# EAGLE design ShaqJr-TOP (EAGLE 9.6.2)
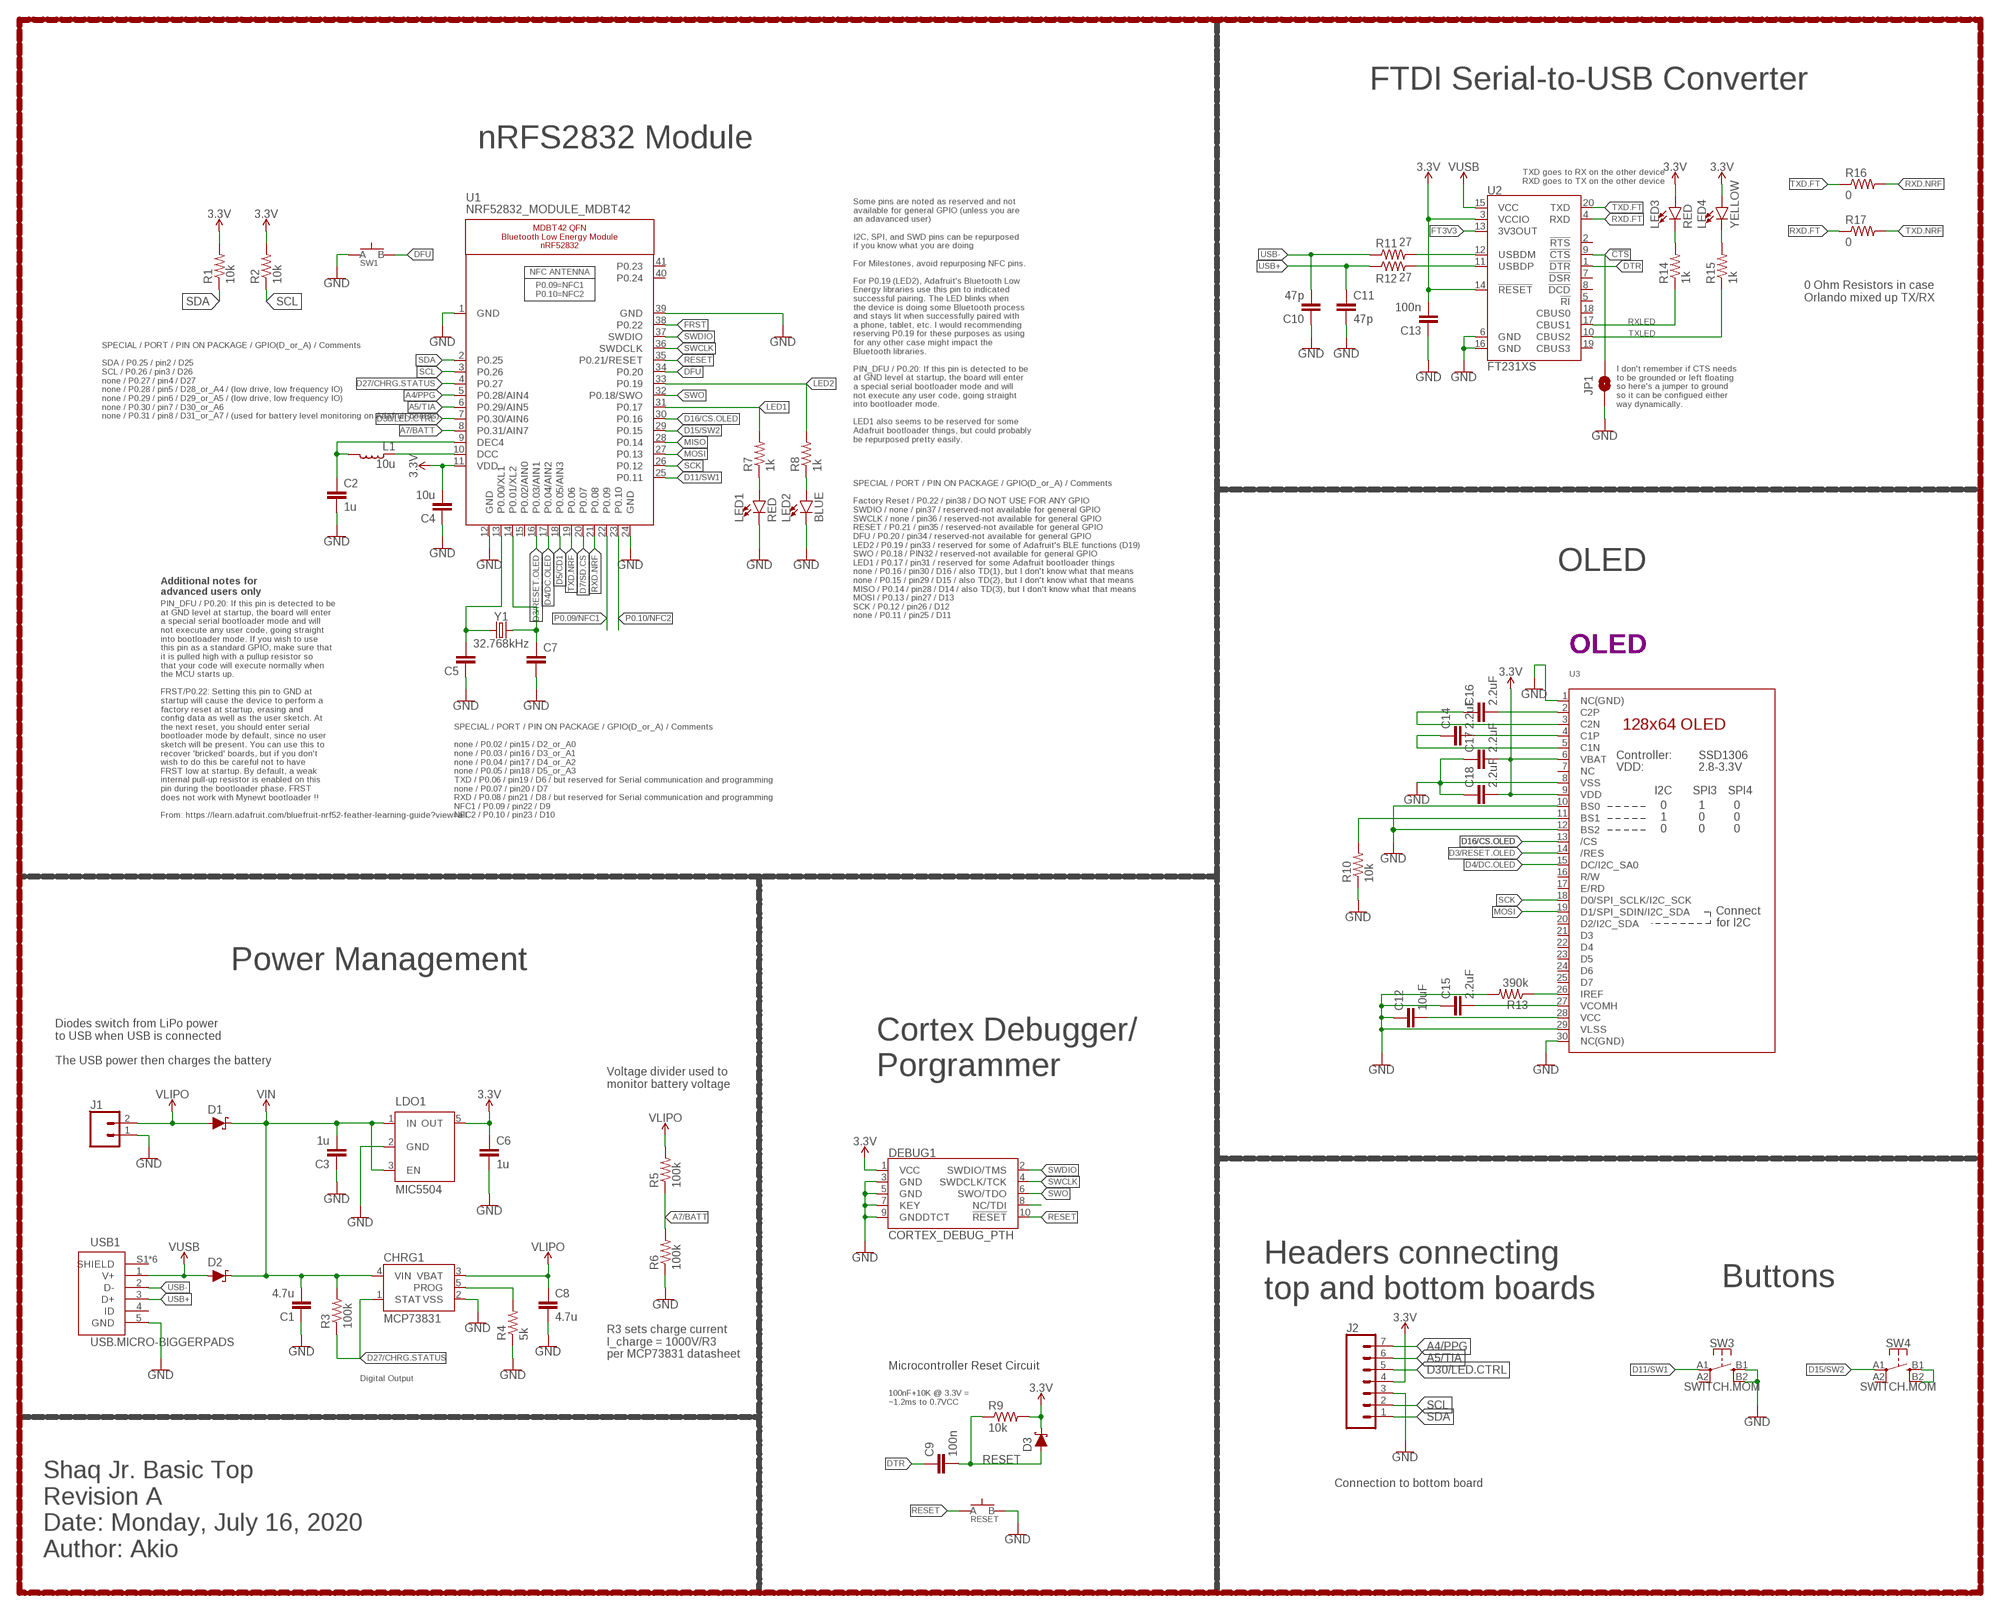
[diagram p0: schematic, sheet 1, part 1 of 2]
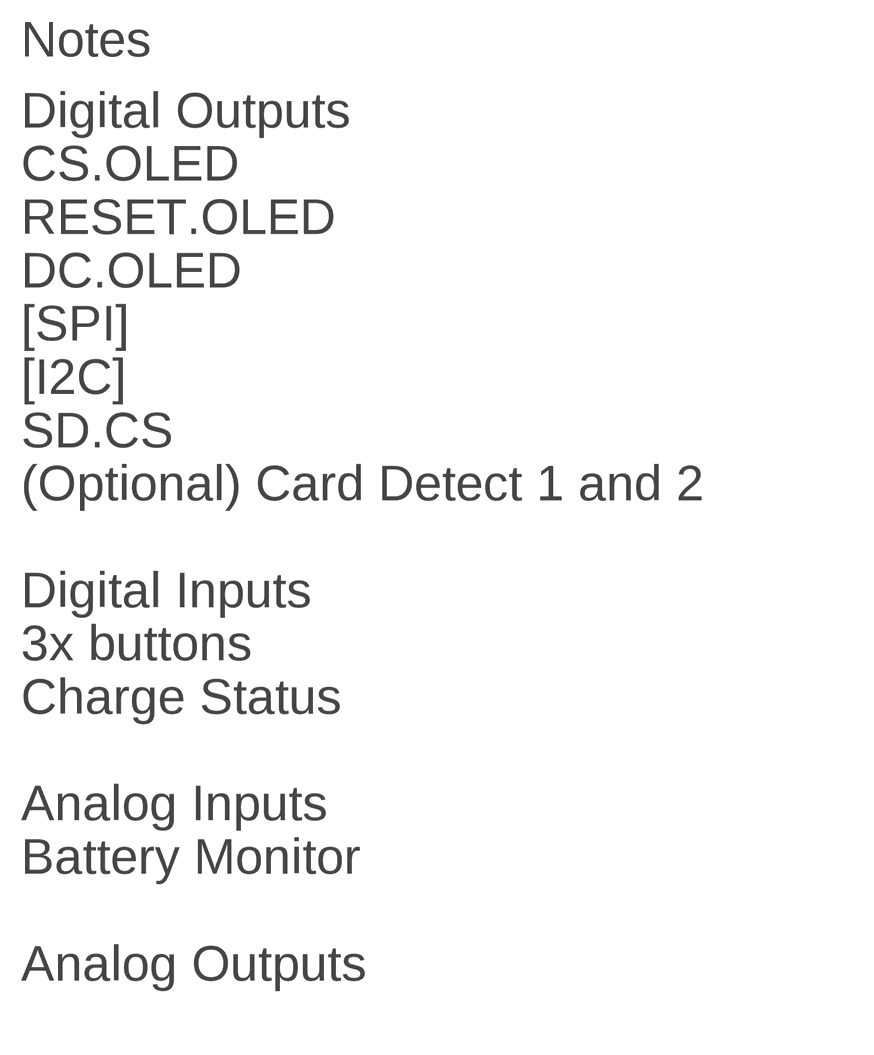
[diagram p1: schematic, sheet 1, part 2 of 2]

## Parts
C1  4.7u  CAPACITOR0603  [C0603]
C2  1u  CAPACITOR0603  [C0603]
C3  1u  CAPACITOR0603  [C0603]
C4  10u  CAPACITOR0805  [C0805]
C5  CAPACITOR0603  [C0603]
C6  1u  CAPACITOR0603  [C0603]
C7  CAPACITOR0603  [C0603]
C8  4.7u  CAPACITOR0603  [C0603]
C9  100n  CAPACITOR0603  [C0603]
C10  47p  CAPACITOR0603  [C0603]
C11  47p  CAPACITOR0603  [C0603]
C12  10uF  CAPACITOR0603  [C0603]
C13  100n  CAPACITOR0603  [C0603]
C14  2.2uF  CAPACITOR0402  [C0402]
C15  2.2uF  CAPACITOR0603  [C0603]
C16  2.2uF  CAPACITOR0402  [C0402]
C17  2.2uF  CAPACITOR0402  [C0402]
C18  2.2uF  CAPACITOR0402  [C0402]
CHRG1  MCP73831  [SOT23-5]
D1  SCHOTTKY-USC  [USC]
D2  SCHOTTKY-USC  [USC]
D3  SCHOTTKY-USC  [USC]
DEBUG1  CORTEX_DEBUG_PTH  [2X5-PTH-1.27MM]
J1  CONN_02  [1X02]
J2  CONN_07-1.27MM  [1X07_1.27MM]
JP1  JUMPER-SMT_2_NO_SILK  [SMT-JUMPER_2_NO_SILK]
L1  10u  INDUCTOR0603  [L0603]
LDO1  MIC5504  [SOT23-5]
LED1  RED  LED0603  [LED-0603]
LED2  BLUE  LED0603  [LED-0603]
LED3  RED  LED0603  [LED-0603]
LED4  YELLOW  LED0603  [LED-0603]
R1  10k  RESISTOR0603  [R0603]
R2  10k  RESISTOR0603  [R0603]
R3  100k  RESISTOR0603  [R0603]
R4  5k  RESISTOR0603  [R0603]
R5  100k  RESISTOR0603  [R0603]
R6  100k  RESISTOR0603  [R0603]
R7  1k  RESISTOR0603  [R0603]
R8  1k  RESISTOR0603  [R0603]
R9  10k  RESISTOR0603  [R0603]
R10  10k  RESISTOR0603  [R0603]
R11  27  RESISTOR0603  [R0603]
R12  27  RESISTOR0603  [R0603]
R13  390k  RESISTOR0603  [R0603]
R14  1k  RESISTOR0603  [R0603]
R15  1k  RESISTOR0603  [R0603]
R16  0  RESISTOR0603  [R0603]
R17  0  RESISTOR0603  [R0603]
RESET  SPST-PTS830GG140-COPY.1-3  [BUTTON-GULLWING]
SW1  SPST-PTS830GG140-COPY.1-3  [BUTTON-GULLWING]
SW3  SWITCH.MOM  [TACTILE_SWITCH_SMD_6.2MM_TALL]
SW4  SWITCH.MOM  [TACTILE_SWITCH_SMD_6.2MM_TALL]
U1  NRF52832_MODULE_MDBT42  [BLE_MODULE_RAYTAC_MDBT42]
U2  FT231XS  [SSOP20_L]
U3  DISP_OLED_UG-2864HSWEG01-NO-WRAPAROUND  [UG-2864HSWEG01_0.96IN_NO-WRAPAROUND]
USB1  USB.MICRO-BIGGERPADS  [USB-MICRO-01.BIGGERPADS]
Y1  32.768kHz  CRYSTALECS-.327-12.5-12-C-TR  [2-SMD.NOLEAD.2.0MMTO1.2MM]

## Nets
3.3V: C4.2 C6.1 C13.2 C17.2 C18.2 D3.-(C) DEBUG1.1(VCC) J2.4 LDO1.5(OUT) LED3.A LED4.A R1.2 R2.2 R9.2 U1.11(VDD) U2.3(VCCIO) U2.14(!RESET) U3.6(VBAT) U3.9(VDD)
!CTS: JP1.2 U2.9(!CTS)
A4/PPG: J2.7 U1.5(P0.28/AIN4)
A5/TIA: J2.6 U1.6(P0.29/AIN5)
A7/BATT: R5.1 R6.2 U1.8(P0.31/AIN7)
D3/RESET.OLED: U1.16(P0.03/AIN1) U3.14(/RES)
D4/DC.OLED: U1.17(P0.04/AIN2) U3.15(DC/I2C_SA0)
D5/CD1: U1.18(P0.05/AIN3)
D7/SD.CS: U1.20(P0.07)
D11/SW1: SW3.A1 U1.25(P0.11)
D15/SW2: SW4.A1 U1.29(P0.15)
D16/CS.OLED: U1.30(P0.16) U3.13(/CS)
D27/CHRG.STATUS: CHRG1.1(STAT) R3.1 U1.4(P0.27)
D30/LED.CTRL: J2.5 U1.7(P0.30/AIN6)
DFU: SW1.3(B) U1.34(P0.20)
DTR: C9.1 U2.1(!DTR)
FRST: U1.38(P0.22)
FT3V3: U2.13(3V3OUT)
GND: C1.1 C2.2 C3.1 C4.1 C5.1 C6.2 C7.2 C8.2 C10.1 C11.2 C12.1 C13.1 C15.1 C17.1 C18.1 CHRG1.2(VSS) DEBUG1.3(GND) DEBUG1.5(GND) DEBUG1.7(KEY) DEBUG1.9(GNDDTCT) J1.1 J2.3 JP1.1 LDO1.2(GND) LED1.C LED2.C R4.1 R6.1 R10.1 R13.2 RESET.3(B) SW1.1(A) U1.1(GND) U1.12(GND) U1.24(GND) U1.39(GND) U2.6(GND) U2.16(GND) U3.1(NC(GND)) U3.8(VSS) U3.10(BS0) U3.12(BS2) U3.29(VLSS) U3.30(NC(GND)) USB1.5(GND)
LED1: R7.2 U1.31(P0.17)
LED2: R8.2 U1.33(P0.19)
MISO: U1.28(P0.14)
MOSI: U1.27(P0.13) U3.19(D1/SPI_SDIN/I2C_SDA)
N$4: R10.2 U3.11(BS1)
N$6: R13.1 U3.26(IREF)
N$7: R11.2 U2.12(USBDM)
N$8: R12.2 U2.11(USBDP)
N$9: C16.2 U3.2(C2P)
N$10: C16.1 U3.3(C2N)
N$11: C14.2 U3.4(C1P)
N$12: C14.1 U3.5(C1N)
N$14: C12.2 U3.28(VCC)
N$15: C15.2 U3.27(VCOMH)
N$16: SW3.B1 SW3.B2 SW4.B1 SW4.B2 ; supply symbol labelled GND
N$17: CHRG1.5(PROG) R4.2
N$18: LED3.C R14.2
N$21: LED4.C R15.2
N$27: C5.2 U1.13(P0.00/XL1) Y1.P$1
N$28: C7.1 U1.14(P0.01/XL2) Y1.P$2
N$29: LED1.A R7.1
N$30: LED2.A R8.1
N$31: L1.1 U1.10(DCC)
N$32: C2.1 L1.2 U1.9(DEC4)
N$33: DEBUG1.8(NC/TDI)
P0.09/NFC1: U1.22(P0.09)
P0.10/NFC2: U1.23(P0.10)
RESET: C9.2 D3.+(A) DEBUG1.10(!RESET) R9.1 RESET.1(A) U1.35(P0.21/RESET)
RXD.FT: R17.1 U2.4(RXD)
RXD.NRF: R16.2 U1.21(P0.08)
RXLED: R14.1 U2.17(CBUS1)
SCK: U1.26(P0.12) U3.18(D0/SPI_SCLK/I2C_SCK)
SCL: J2.2 R2.1 U1.3(P0.26)
SDA: J2.1 R1.1 U1.2(P0.25)
SWCLK: DEBUG1.4(SWDCLK/TCK) U1.36(SWDCLK)
SWDIO: DEBUG1.2(SWDIO/TMS) U1.37(SWDIO)
SWO: DEBUG1.6(SWO/TDO) U1.32(P0.18/SWO)
TXD.FT: R16.1 U2.20(TXD)
TXD.NRF: R17.2 U1.19(P0.06)
TXLED: R15.1 U2.10(CBUS2)
USB+: C11.1 R12.1 USB1.3(D+)
USB-: C10.2 R11.1 USB1.2(D-)
V_USB: D2.+(A) U2.15(VCC) USB1.1(V+) ; supply symbol labelled VUSB
VIN: C1.2 C3.2 CHRG1.4(VIN) D1.-(C) D2.-(C) LDO1.1(IN) LDO1.3(EN) R3.2
VLIPO: C8.1 CHRG1.3(VBAT) D1.+(A) J1.2 R5.2
Unconnected: SW3.A2 SW4.A2 U1.15(P0.02/AIN0) U1.40(P0.24) U1.41(P0.23) U2.2(!RTS) U2.5(!RI) U2.7(!DSR) U2.8(!DCD) U2.18(CBUS0) U2.19(CBUS3) U3.7(NC) U3.16(R/W) U3.17(E/RD) U3.20(D2/I2C_SDA) U3.21(D3) U3.22(D4) U3.23(D5) U3.24(D6) U3.25(D7) USB1.4(ID) USB1.S1(SHIELD) USB1.S2(SHIELD) USB1.S3(SHIELD) USB1.S4(SHIELD) USB1.S5(SHIELD) USB1.S6(SHIELD)

## Notes on the sheet
- FTDI Serial-to-USB Converter
- nRFS2832 Module
- TXD goes to RX on the other device
  RXD goes to TX on the other device
- 0 Ohm Resistors in case
  Orlando mixed up TX/RX
- I don't remember if CTS needs
  to be grounded or left floating
  so here's a jumper to ground
  so it can be configued either
  way dynamically.
- SPECIAL / PORT / PIN ON PACKAGE / GPIO(D_or_A) / Comments
  
  SDA / P0.25 / pin2 / D25
  SCL / P0.26 / pin3 / D26
  none / P0.27 / pin4 / D27
  none / P0.28 / pin5 / D28_or_A4 / (low drive, low frequency IO)
  none / P0.29 / pin6 / D29_or_A5 / (low drive, low frequency IO)
  none / P0.30 / pin7 / D30_or_A6
  none / P0.31 / pin8 / D31_or_A7 / (used for battery level monitoring on Adafruit boards)
- Some pins are noted as reserved and not
  available for general GPIO (unless you are
  an adavanced user)
  
  I2C, SPI, and SWD pins can be repurposed
  if you know what you are doing
  
  For Milestones, avoid repurposing NFC pins.
  
  For P0.19 (LED2), Adafruit's Bluetooth Low
  Energy libraries use this pin to indicated
  successful pairing. The LED blinks when
  the device is doing some Bluetooth process
  and stays lit when successfully paired with
  a phone, tablet, etc. I would recommending
  reserving P0.19 for these purposes as using
  for any other case might impact the
  Bluetooth libraries.
  
  PIN_DFU / P0.20: If this pin is detected to be
  at GND level at startup, the board will enter
  a special serial bootloader mode and will
  not execute any user code, going straight
  into bootloader mode.
  
  LED1 also seems to be reserved for some
  Adafruit bootloader things, but could probably
  be repurposed pretty easily.
- OLED
- Additional notes for
  advanced users only
- SPECIAL / PORT / PIN ON PACKAGE / GPIO(D_or_A) / Comments
  
  Factory Reset / P0.22 / pin38 / DO NOT USE FOR ANY GPIO
  SWDIO / none / pin37 / reserved-not available for general GPIO
  SWCLK / none / pin36 / reserved-not available for general GPIO
  RESET / P0.21 / pin35 / reserved-not available for general GPIO
  DFU / P0.20 / pin34 / reserved-not available for general GPIO
  LED2 / P0.19 / pin33 / reserved for some of Adafruit's BLE functions (D19)
  SWO / P0.18 / PIN32 / reserved-not available for general GPIO
  LED1 / P0.17 / pin31 / reserved for some Adafruit bootloader things
  none / P0.16 / pin30 / D16 / also TD(1), but I don't know what that means
  none / P0.15 / pin29 / D15 / also TD(2), but I don't know what that means
  MISO / P0.14 / pin28 / D14 / also TD(3), but I don't know what that means
  MOSI / P0.13 / pin27 / D13
  SCK / P0.12 / pin26 / D12
  none / P0.11 / pin25 / D11
- OLED
- PIN_DFU / P0.20: If this pin is detected to be
  at GND level at startup, the board will enter
  a special serial bootloader mode and will
  not execute any user code, going straight
  into bootloader mode. If you wish to use
  this pin as a standard GPIO, make sure that
  it is pulled high with a pullup resistor so
  that your code will execute normally when
  the MCU starts up.
  
  FRST/P0.22: Setting this pin to GND at
  startup will cause the device to perform a
  factory reset at startup, erasing and
  config data as well as the user sketch. At
  the next reset, you should enter serial
  bootloader mode by default, since no user
  sketch will be present. You can use this to
  recover 'bricked' boards, but if you don't
  wish to do this be careful not to have
  FRST low at startup. By default, a weak
  internal pull-up resistor is enabled on this
  pin during the bootloader phase. FRST
  does not work with Mynewt bootloader !!
  
  From: https://learn.adafruit.com/bluefruit-nrf52-feather-learning-guide?view=all
- SPECIAL / PORT / PIN ON PACKAGE / GPIO(D_or_A) / Comments
  
  none / P0.02 / pin15 / D2_or_A0
  none / P0.03 / pin16 / D3_or_A1
  none / P0.04 / pin17 / D4_or_A2
  none / P0.05 / pin18 / D5_or_A3
  TXD / P0.06 / pin19 / D6 / but reserved for Serial communication and programming
  none / P0.07 / pin20 / D7
  RXD / P0.08 / pin21 / D8 / but reserved for Serial communication and programming
  NFC1 / P0.09 / pin22 / D9
  NFC2 / P0.10 / pin23 / D10
- Power Management
- Diodes switch from LiPo power 
  to USB when USB is connected
  
  The USB power then charges the battery
- Cortex Debugger/
  Porgrammer
- Voltage divider used to
  monitor battery voltage
- Buttons
- Headers connecting
  top and bottom boards
- R3 sets charge current
  I_charge = 1000V/R3
  per MCP73831 datasheet
- Microcontroller Reset Circuit
- Digital Output
- 100nF+10K @ 3.3V =
  ~1.2ms to 0.7VCC
- Connection to bottom board
- Shaq Jr. Basic Top
  Revision A
  Date: Monday, July 16, 2020
  Author: Akio
- Notes
- Digital Outputs
  CS.OLED
  RESET.OLED
  DC.OLED
  [SPI]
  [I2C]
  SD.CS
  (Optional) Card Detect 1 and 2
  
  Digital Inputs
  3x buttons
  Charge Status
  
  Analog Inputs
  Battery Monitor
  
  Analog Outputs

## Library data of the parts
C1-C18 = LinnesLab-Passives:CAPACITOR
CHRG1 = LinnesLab-Power:MCP73831: MCP73831T Li-Ion, Li-Pol Controller Miniature single cell, fully integrated Li-Ion, Li-polymer charge management controller Datasheet <http://ww1.microchip.com/downloads/en/DeviceDoc/20001984g.pdf> SparkFun Products: SparkFun ESP32 Thing <https://www.sparkfun.com/products/13907> SparkFun 9DoF Razor IMU M0 <https://www.sparkfun.com/products/14001>; PROD_ID: IC-09995
D1-D3 = LinnesLab-DiscreteSemi:SCHOTTKY: Schottky diode A Schottky diode is a semiconductor diode which has a low forward voltage drop and a very fast switching action. Example: Digi-Key Part Number: RB161MM-20CT-ND
DEBUG1 = LinnesLab-Connectors:CORTEX_DEBUG: Cortex Debug Connector - 10 pin Supports JTAG debug, Serial Wire debug, and Serial Wire Viewer. PTH and SMD connector options available. General Connector Information <http://infocenter.arm.com/help/topic/com.arm.doc.faqs/attached/13634/cortex_debug_connectors.pdf> Products: PTH Connector <http://www.digikey.com/product-detail/en/cnc-tech/3220-10-0100-00/1175-1627-ND/3883661> -via Digi-Key SparkFun PSoc <https://www.sparkfun.com/products/13229> SparkFun T <https://www.sparkfun.com/products/13810>
J1 = LinnesLab-Connectors:CONN_02: Multi connection point. Often used as Generic Header-pin footprint for 0.1 inch spaced/style header connections On any of the 0.1 inch spaced packages, you can populate with these: Break Away Headers - Straight <https://www.sparkfun.com/products/116> (PRT-00116) Break Away Male Headers - Right Angle <https://www.sparkfun.com/products/553> (PRT-00553) Female Headers <https://www.sparkfun.com/products/115> (PRT-00115) Break Away Headers - Machine Pin <https://www.sparkfun.com/products/117> (PRT-00117) Break Away Female Headers - Swiss Machine Pin <https://www.sparkfun.com/products/743> (PRT-00743) For SCREWTERMINALS and SPRING TERMINALS visit here: Screw Terimnals on SparkFun.com <https://www.sparkfun.com/search/results?term=Screw+Terminals> (5mm/3.5mm/2.54mm spacing) This device is also useful as a general connection point to wire up your design to another part of your project. Our various solder wires solder well into these plated through hole pads. Hook-Up Wire - Assortment (Stranded, 22 AWG) <https://www.sparkfun.com/products/11375> (PRT-11375) Hook-Up Wire - Assortment (Solid Core, 22 AWG) <https://www.sparkfun.com/products/11367> (PRT-11367) View the entire wire category on our website here <https://www.sparkfun.com/categories/141> Special notes: Molex polarized connector foot print use with: PRT-08233 with associated crimp pins and housings. 2.54_SCREWTERM for use with PRT-10571. 3.5mm Screw Terminal footprints for PRT-08084 5mm Screw Terminal footprints for use with PRT-08432
J2 = LinnesLab-Connectors:CONN_07: Multi connection point. Often used as Generic Header-pin footprint for 0.1 inch spaced/style header connections On any of the 0.1 inch spaced packages, you can populate with these: Break Away Headers - Straight <https://www.sparkfun.com/products/116> (PRT-00116) Break Away Male Headers - Right Angle <https://www.sparkfun.com/products/553> (PRT-00553) Female Headers <https://www.sparkfun.com/products/115> (PRT-00115) Break Away Headers - Machine Pin <https://www.sparkfun.com/products/117> (PRT-00117) Break Away Female Headers - Swiss Machine Pin <https://www.sparkfun.com/products/743> (PRT-00743) For SCREWTERMINALS and SPRING TERMINALS visit here: Screw Terimnals on SparkFun.com <https://www.sparkfun.com/search/results?term=Screw+Terminals> (5mm/3.5mm/2.54mm spacing) This device is also useful as a general connection point to wire up your design to another part of your project. Our various solder wires solder well into these plated through hole pads. Hook-Up Wire - Assortment (Stranded, 22 AWG) <https://www.sparkfun.com/products/11375> (PRT-11375) Hook-Up Wire - Assortment (Solid Core, 22 AWG) <https://www.sparkfun.com/products/11367> (PRT-11367) View the entire wire category on our website here <https://www.sparkfun.com/categories/141> Special notes: Molex polarized connector foot print use with SKU : PRT-08231 with associated crimp pins and housings. 1MM SMD Version SKU: PRT-10208 NOTES ON THE VARIANTS LOCK and LOCK_LONGPADS... This footprint was designed to help hold the alignment of a through-hole component (i.e. 6-pin header) while soldering it into place. You may notice that each hole has been shifted either up or down by 0.005 of an inch from it's more standard position (which is a perfectly straight line). This slight alteration caused the pins (the squares in the middle) to touch the edges of the holes. Because they are alternating, it causes a "brace" to hold the component in place. 0.005 has proven to be the perfect amount of "off-center" position when using our standard breakaway headers. Although looks a little odd when you look at the bare footprint, once you have a header in there, the alteration is very hard to notice. Also,if you push a header all the way into place, it is covered up entirely on the bottom side.
JP1 = LinnesLab-Switches:JUMPER-SMT_2_NO: Normally open jumper This jumper has two pads in close proximity to each other. Apply solder to close the connection. Round pads are easier to solder for beginners, but are a lot larger. SparkFun Product that uses the round pads: SparkFun EL Sequencer <https://www.sparkfun.com/products/12781>
L1 = LinnesLab-Passives:INDUCTOR
LDO1 = LinnesLab-Power:MIC5504: MIC5504 Voltage Regulator Output Voltages: 1.0V to 3.3V Input Voltages: 2.5V to 5.5V Link to Datasheet http://ww1.microchip.com/downloads/en/DeviceDoc/MIC550X.pdf
LED1-LED4 = LinnesLab-LED:LED: LED (Generic) Standard schematic elements and footprints for 5mm, 3mm, 1206, and 0603 sized LEDs. Generic LEDs with no color specified. LTST-C190KGKT: arrow indicates cathode
R1-R17 = LinnesLab-Passives:RESISTOR
RESET SW1 = LinnesLab-Switches:SPST-PTS830GG140-COPY
SW3 SW4 = LinnesLab-Switches:SWITCH.MOM: PTS645SM43SMTR92 LFS
U1 = LinnesLab-Microcontrollers:NRF52832_MODULE_MDBT42: MDBT42 - BLE Module (nRF52832 QFN) VDD: 1.7-3.6V
U2 = LinnesLab-DigitalIC:FT231X: FTDI FT231X Full Speed USB to Full-handshake UART This USB2.0 Full Speed IC offers a compact bridge to full handshake UART interfaces. The device is a UART, capable of operating up to 3MBaud, with low power consumption (8mA). The FT231X includes the complete FT-X series feature set and enables USB to be added into a system design quickly and easily over a UART interface. Datasheet <http://cdn.sparkfun.com/datasheets/Components/General%20IC/DS_FT231X.pdf>; DIGIKEY: 768-1156-5-ND; MFN: FT231XS-U
U3 = LinnesLab-Displays:DISP_OLED_UG-2864HSWEG01: UG-2864HSWEG01 OLED display Both 1.3" and 0.96" models share the same FPC tab footprint, only the screen dimensions vary.
USB1 = LinnesLab-Connectors:USB.MICRO: DigiKey PN: 609-4613-1-ND
Y1 = LinnesLab-Clocks:CRYSTAL; DIGIKEY: XC2288CT-ND; FREQ: 32.7680KHZ; LOAD_CAP: 12.5pF

## Board
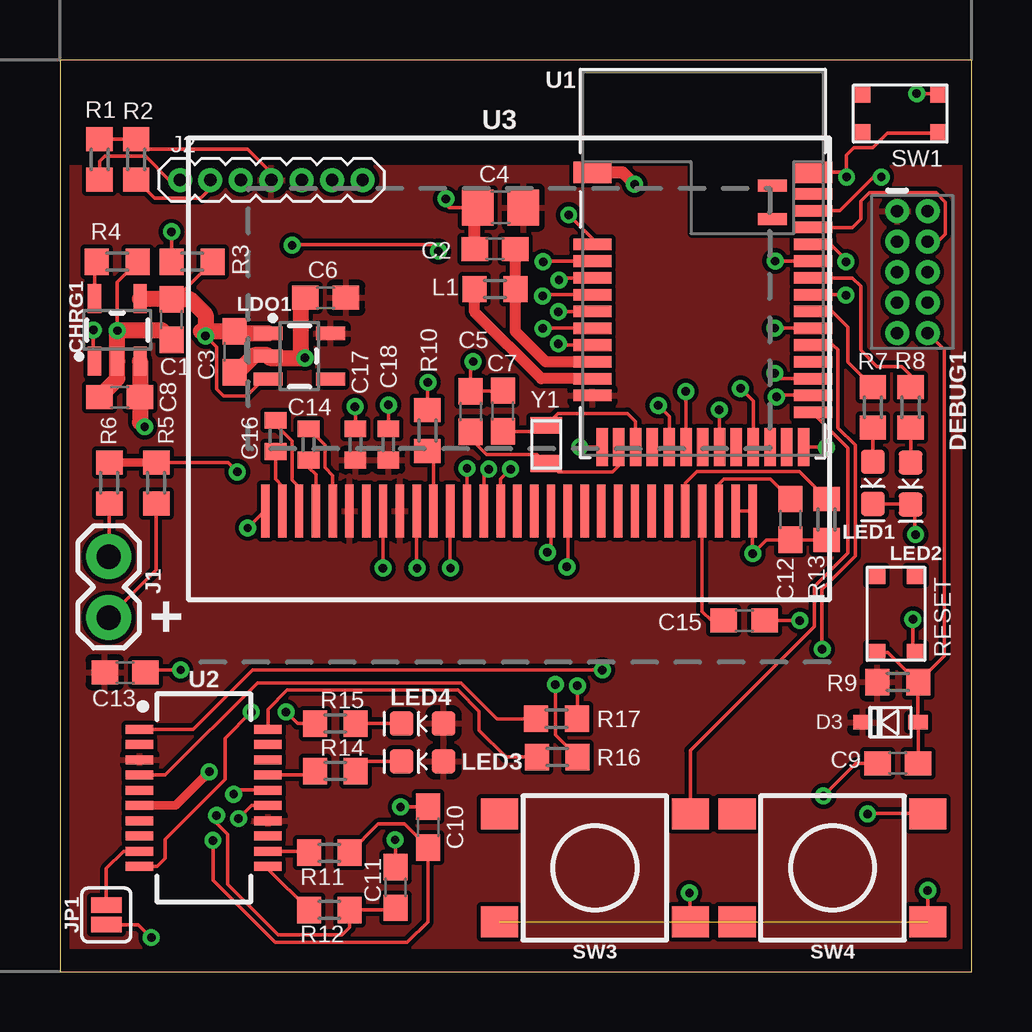
[diagram p2: board, top side]
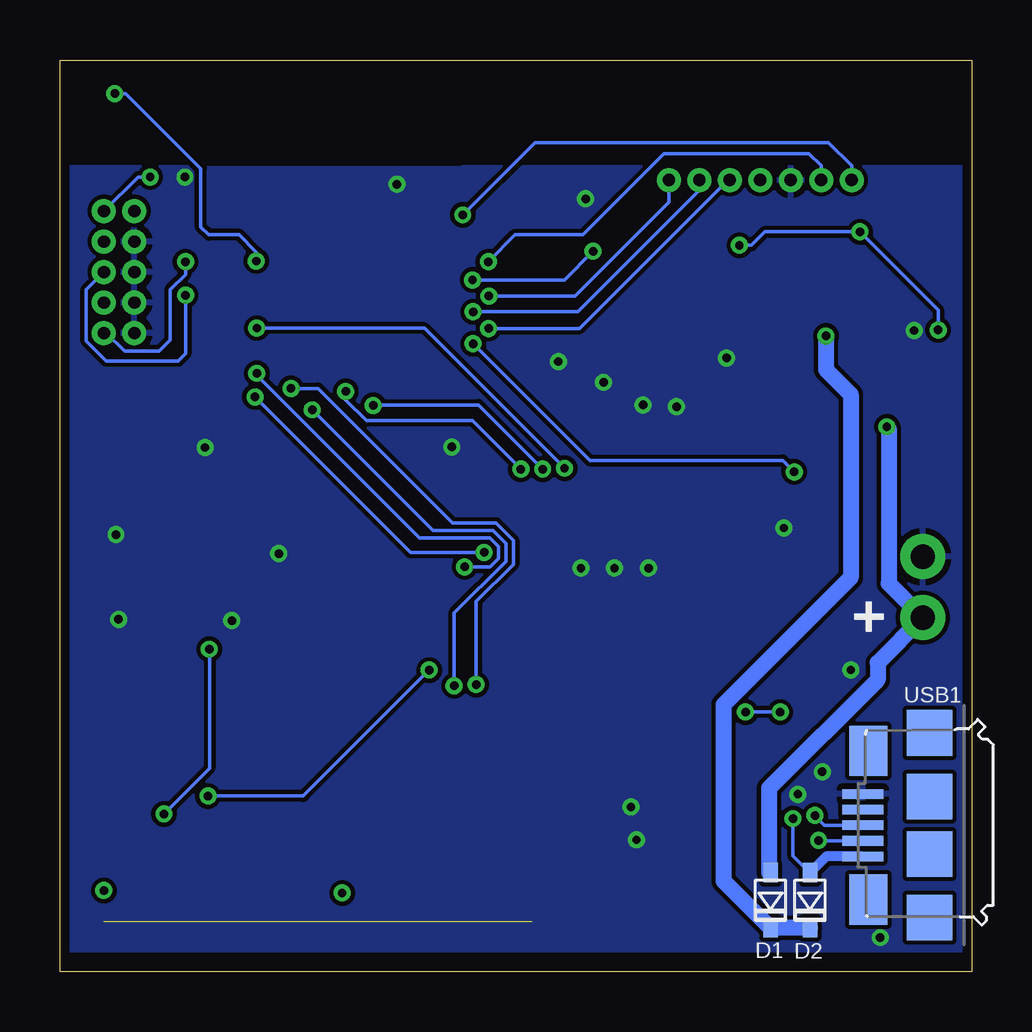
[diagram p3: board, bottom side, seen from below]

Size 38 x 38 mm. Coordinates in mm from the lower left corner, seen from the top.
Outline: 0,0 38,0 38,38 0,38 0,0
Copper layers (1*16): Top 0.0356mm / dielectric 1.5011mm / Bottom 0.0356mm
Design rules "LaenPCBOrder": minimum track width 6mil, minimum drill 13mil, track to track 6mil, track to pad 6mil, pad to pad 6mil, via to via 6mil, smd to smd 6mil, copper to edge 15mil, drill to drill 6mil, minimum pad ring 7mil, minimum via ring 7mil, stop-mask expansion 3mil, vias tented up to drill 0mil, thermal gap 10mil

### Footprints (pad centres in the part's own frame; a part is rotated, then mirrored left to right if it is on the bottom)
C0603 = smd 1.1 x 1: 1 -0.85,0; 2 0.85,0
C0805 = smd 1.3 x 1.5: 1 -0.95,0; 2 0.95,0
C0402 = smd 0.7 x 0.9: 1 -0.65,0; 2 0.65,0
SOT23-5 = smd 0.55 x 1.2: 1 -0.95,-1.3; 2 0,-1.3; 3 0.95,-1.3; 4 0.95,1.3; 5 -0.95,1.3
USC = smd 0.8 x 0.6: + -1.15,0; - 1.15,0
2X5-PTH-1.27MM = drill 0.508 pad 1: 1 -2.54,-0.635; 2 -2.54,0.635; 3 -1.27,-0.635; 4 -1.27,0.635; 5 0,-0.635; 6 0,0.635; 7 1.27,-0.635; 8 1.27,0.635; 9 2.54,-0.635; 10 2.54,0.635
1X02 = drill 1.016 pad 1.88: 1 0,0; 2 2.54,0
1X07_1.27MM = drill 0.508 pad 1: 1 0,0; 2 1.27,0; 3 2.54,0; 4 3.81,0; 5 5.08,0; 6 6.35,0; 7 7.62,0
SMT-JUMPER_2_NO_SILK = smd 0.635 x 1.27: 1 -0.406,0; 2 0.406,0
L0603 = smd 1 x 1.1: 1 -0.85,0; 2 0.85,0
LED-0603 = smd 1 x 1: A -0.877,0; C 0.877,0
R0603 = smd 1 x 1.1: 1 -0.85,0; 2 0.85,0
BUTTON-GULLWING = smd 0.7 x 0.75: 1 -1.6,0.825; 2 1.6,0.825; 3 -1.6,-0.825; 4 1.6,-0.825
TACTILE_SWITCH_SMD_6.2MM_TALL = smd 1.55 x 1.3: A1 -3.975,-2.25; A2 3.975,-2.25; B1 -3.975,2.25; B2 3.975,2.25
BLE_MODULE_RAYTAC_MDBT42 = smd 1.6 x 0.9: 1 -4.6,3.8; 39 4.6,3.8 | smd 1.6 x 0.48: 2 -4.6,0.8; 3 -4.6,0.1; 4 -4.6,-0.6; 5 -4.6,-1.3; 6 -4.6,-2; 7 -4.6,-2.7; 8 -4.6,-3.4; 9 -4.6,-4.1; 10 -4.6,-4.8; 11 -4.6,-5.5; 25 4.6,-6.2; 26 4.6,-5.5; 27 4.6,-4.8; 28 4.6,-4.1; 29 4.6,-3.4; 30 4.6,-2.7; 31 4.6,-2; 32 4.6,-1.3; 33 4.6,-0.6; 34 4.6,0.1; 35 4.6,0.8; 36 4.6,1.5; 37 4.6,2.2; 38 4.6,2.9 | smd 0.48 x 1.6: 12 -4.2,-7.65; 13 -3.5,-7.65; 14 -2.8,-7.65; 15 -2.1,-7.65; 16 -1.4,-7.65; 17 -0.7,-7.65; 18 0,-7.65; 19 0.7,-7.65; 20 1.4,-7.65; 21 2.1,-7.65; 22 2.8,-7.65; 23 3.5,-7.65; 24 4.2,-7.65 | smd 1.2 x 0.5: 40 2.9,3.25; 41 2.9,1.85
SSOP20_L = smd 0.381 x 1.143: 1 -2.857,-2.68; 2 -2.223,-2.68; 3 -1.587,-2.68; 4 -0.953,-2.68; 5 -0.318,-2.68; 6 0.318,-2.68; 7 0.953,-2.68; 8 1.587,-2.68; 9 2.223,-2.68; 10 2.857,-2.68; 11 2.857,2.68; 12 2.223,2.68; 13 1.587,2.68; 14 0.953,2.68; 15 0.318,2.68; 16 -0.318,2.68; 17 -0.953,2.68; 18 -1.587,2.68; 19 -2.223,2.68; 20 -2.857,2.68
UG-2864HSWEG01_0.96IN_NO-WRAPAROUND = smd 0.35 x 2.2: 1 -10.15,-1.2; 2 -9.45,-1.2; 3 -8.75,-1.2; 4 -8.05,-1.2; 5 -7.35,-1.2; 6 -6.65,-1.2; 7 -5.95,-1.2; 8 -5.25,-1.2; 9 -4.55,-1.2; 10 -3.85,-1.2; 11 -3.15,-1.2; 12 -2.45,-1.2; 13 -1.75,-1.2; 14 -1.05,-1.2; 15 -0.35,-1.2; 16 0.35,-1.2; 17 1.05,-1.2; 18 1.75,-1.2; 19 2.45,-1.2; 20 3.15,-1.2; 21 3.85,-1.2; 22 4.55,-1.2; 23 5.25,-1.2; 24 5.95,-1.2; 25 6.65,-1.2; 26 7.35,-1.2; 27 8.05,-1.2; 28 8.75,-1.2; 29 9.45,-1.2; 30 10.15,-1.2
USB-MICRO-01.BIGGERPADS = smd 0.4 x 1.7: 1 -1.3,1.505; 2 -0.65,1.505; 3 0,1.505; 4 0.65,1.505; 5 1.3,1.505 | smd 1.9 x 1.9: S1 -3.85,-1.27; S2 -1.2,-1.27; S3 1.2,-1.27; S4 3.85,-1.27 | smd 2.1 x 1.6: S5 -3.1,1.28; S6 3.1,1.28
2-SMD.NOLEAD.2.0MMTO1.2MM = smd 0.7 x 1.3: P$1 -0.8,0; P$2 0.8,0

### Placement (x,y rotation side)
C1  4.65,27.18 90 top
C2  18.14,30.12 180 top
C3  7.29,25.83 90 top
C4  18.36,31.85 0 top
C5  17.12,23.34 270 top
C6  11.07,28.09 180 top
C7  18.47,23.37 90 top
C8  2.49,23.95 180 top
C9  34.92,8.69 0 top
C10  15.34,6.02 270 top
C11  14,3.51 90 top
C12  30.45,18.85 90 top
C13  2.72,12.47 180 top
C14  10.36,21.97 270 top
C15  28.52,14.63 180 top
C16  8.99,22.33 270 top
C17  12.32,21.97 270 top
C18  13.69,21.97 270 top
CHRG1  2.39,26.75 0 top
D1  8.38,2.97 270 bottom
D2  6.73,2.97 270 bottom
D3  34.62,10.39 180 top
DEBUG1  35.53,29.16 270 top
J1  2.03,17.3 270 top
J2  5,33 0 top
JP1  1.93,2.36 90 top
L1  18.14,28.45 0 top
LDO1  9.98,25.65 270 top
LED1  33.88,20.37 270 top
LED2  35.46,20.35 270 top
LED3  15.11,8.76 180 top
LED4  15.11,10.34 180 top
R1  1.65,33.86 90 top
R2  3.17,33.86 90 top
R3  5.51,29.59 0 top
R4  2.39,29.59 180 top
R5  4.01,20.37 270 top
R6  2.06,20.37 90 top
R7  33.88,23.52 90 top
R8  35.46,23.52 90 top
R9  34.92,12.06 180 top
R10  15.32,22.56 270 top
R11  11.23,4.95 180 top
R12  11.23,2.57 180 top
R13  31.95,18.85 270 top
R14  11.48,8.36 0 top
R15  11.48,10.34 0 top
R16  20.73,8.94 0 top
R17  20.7,10.54 0 top
RESET  34.85,14.91 90 top
SW1  35.03,35.76 180 top
SW3  22.3,4.32 180 top
SW4  32.21,4.32 180 top
U1  26.8,29.51 0 top
U2  5.99,7.24 270 top
U3  18.72,20.4 0 top
USB1  3.02,6.1 90 bottom
Y1  20.27,21.97 90 top

### Tracks (layer width: path | path; a pad name or v marks a point on that pad's centre or on a via)
3.3V
  Top 0.152: R1.2 R2.2 3.6,34.28 7.83,34.28 8.81,33.3 J2.4
  pour Top (isolate 0.178): 0.13,33.55 37.64,33.55 37.64,1.02 0.13,1.02
!CTS
  Top 0.152: JP1.2 1.93,4.29 2.65,5.02 U2.9
A4/PPG  (via drill 0.35)
  Top 0.152: U1.5 20.17,28.21 v20.12,28.16
  Bottom 0.152: J2.7 12.62,32.06 16.52,28.16 v20.12,28.16
A5/TIA  (via drill 0.35)
  Top 0.152: U1.6 v20.78,27.52 v20.78,27.51
  Bottom 0.152: v20.78,27.51 16.41,27.51 11.35,32.57 J2.6
A7/BATT  (via drill 0.35)
  Top 0.152: U1.8 20.84,26.11 v20.78,26.17 | v7.39,20.83 7.01,21.21 4.03,21.21 R5.1
  Top 0.356: R5.1 R6.2
  Bottom 0.152: v20.78,26.17 15.91,21.31 7.87,21.31 v7.39,20.83
D3/RESET.OLED  (via drill 0.35)
  Top 0.152: U3.14 17.67,20.74 v17.88,20.95 | v24.94,23.6 25.4,23.14 U1.16
  Bottom 0.152: v17.88,20.95 20.55,23.62 24.92,23.62 v24.94,23.6
D4/DC.OLED  (via drill 0.35)
  Top 0.152: U3.15 18.37,20.53 v18.79,20.95 | v26.09,24.18 26.09,21.88 U1.17
  Bottom 0.152: v26.09,24.18 26.09,23.83 25.22,22.96 20.8,22.96 v18.79,20.95
D11/SW1
  Top 0.152: U1.25 31.4,23.26 32.84,21.82 32.84,17.45 31.44,16.05 31.44,14.38 26.28,9.21 SW3.A1
D15/SW2  (via drill 0.35)
  Top 0.152: U1.29 32.23,26.11 32.43,25.92 32.43,22.67 33.15,21.95 33.15,17.32 31.75,15.93 31.75,13.46 v31.77,13.44 | v33.67,6.57 33.69,6.59 36.16,6.59 SW4.A1
  Bottom 0.152: v31.77,13.44 31.76,13.42 31.76,8.47 v33.67,6.57
D16/CS.OLED  (via drill 0.35)
  Top 0.152: U3.13 v16.97,20.98 | v29.79,26.82 29.8,26.82 U1.30
  Bottom 0.152: v16.97,20.98 22.81,26.82 v29.79,26.82
D27/CHRG.STATUS  (via drill 0.35)
  Top 0.152: R3.1 4.66,30.82 v4.65,30.84 | v1.39,26.75 1.39,25.49 CHRG1.1 | U1.4 20.89,28.91 v20.8,28.83 | v15.77,30.02 15.49,30.3 9.7,30.3 v9.68,30.28
  Bottom 0.152: v1.39,26.75 1.39,27.58 v4.65,30.84 8.61,30.84 9.17,30.28 v9.68,30.28 | v20.8,28.83 16.97,28.83 v15.77,30.02
D30/LED.CTRL  (via drill 0.35)
  Top 0.152: U1.7 v20.13,26.82 v20.13,26.81
  Bottom 0.152: v20.13,26.81 16.35,26.81 10.16,33 J2.5
DFU  (via drill 0.35)
  Top 0.152: U1.34 v29.82,29.61 v29.82,29.62 | SW1.3 35.73,36.59 v35.71,36.6
  Bottom 0.152: v29.82,29.62 29.82,30 30.53,30.71 31.8,30.71 32.13,31.04 32.13,33.47 35.27,36.6 v35.71,36.6
DTR  (via drill 0.35)
  Top 0.152: U2.1 5.55,10.1 8.02,12.57 v22.61,12.57 | C9.1 33.19,8.69 v31.83,7.33 v31.83,7.32
  Bottom 0.152: v22.61,12.57 27.86,7.32 v31.83,7.32
GND  (via drill 0.35)
  Top 0.152: U3.1 8.53,19.2 v7.82,18.49 | v12.29,23.55 12.32,23.52 C17.1 | C18.1 v13.69,23.62 | U3.8 13.47,16.82 v13.46,16.82 | U3.10 14.87,16.83 v14.88,16.82 | U3.12 16.27,16.83 v16.28,16.82 | U3.29 U3.30 28.87,17.43 v28.88,17.42 29.45,18 C12.1 R13.2 | C10.1 v14.21,6.87 v14.2,6.86 | C11.2 13.99,5.46 v13.97,5.49 | R10.1 15.32,24.54 v15.34,24.56 | U1.12 v21.67,21.86 v21.67,21.87 | LED1.C 35.43,19.49 LED2.C 35.64,19.29 35.64,18.24 v35.67,18.21 | U1.24 31.93,21.86 v31.95,21.84 | RESET.3 35.56,13.42 v35.56,14.68 | U1.39 32.6,33.31 v32.79,33.12 32.79,34.03 33.1,34.34 33.88,34.34 34.48,34.94 SW1.1 | v30.84,14.63 C15.1 | C4.1 16.22,31.85 16.09,31.98 v16.09,32.21 | U2.16 7.42,7.57 v7.24,7.39 | JP1.1 3.27,1.96 v3.81,1.42 | C13.1 3.67,12.57 v5.03,12.57 | C7.2 18.44,24.19 C5.1 17.12,25.32 v17.22,25.43 | R4.1 2.39,28.74 v2.39,26.72 | R6.1 2.06,17.32 J1.1
  Top 0.356: U2.6 4.81,6.92 v6.22,8.33
  Top 0.508: C2.2 17.29,31.72 C4.1 | U1.1 23.45,33.31 v23.95,32.82
  Top 0.66: C8.2 2.31,24.62 2.31,24.65 2.39,24.73 CHRG1.2 v2.39,26.72 4.25,26.72 C1.1 | C6.2 10.03,27.9 10.03,25.76 v10.21,25.58 8.76,25.58 LDO1.2 8.65,25.69 8.11,25.69 7.4,24.98 C3.1
  pour Bottom (isolate 0.178): 0.13,33.55 37.8,33.55 37.8,0.86 0.13,0.86
LED1
  Top 0.152: U1.31 32.2,27.52 32.84,26.87 32.84,25.41 R7.2
LED2
  Top 0.152: U1.33 33.04,28.91 33.38,28.57 33.38,25.91 34.06,25.22 35.09,25.22 35.46,24.85 R8.2
MOSI  (via drill 0.35)
  Top 0.152: U3.19 21.17,16.91 v21.13,16.87 | v29.79,24.94 30.02,24.71 U1.27
  Bottom 0.152: v29.79,24.94 29.79,24.87 23.01,18.08 20.07,18.08 19.71,17.73 19.71,17.22 20.07,16.87 v21.13,16.87
N$4
  Top 0.152: U3.11 15.57,21.46 R10.2
N$6
  Top 0.152: U3.26 26.07,20.36 26.55,20.84 30.83,20.84 R13.1
N$7
  Top 0.152: U2.12 10.31,5.02 R11.2
N$8
  Top 0.152: R12.2 8.67,4.27 U2.11
N$9
  Top 0.152: C16.2 8.99,20.52 9.27,20.25 U3.2
N$10
  Top 0.152: C16.1 8.99,22.81 9.68,22.12 9.68,20.5 9.97,20.2 U3.3
N$11
  Top 0.152: C14.2 10.36,21.02 10.67,20.71 U3.4
N$12
  Top 0.152: U3.5 11.37,20.68 11.05,21.01 11.05,21.95 10.37,22.62 C14.1
N$14
  Top 0.152: C12.2 29.62,20.53 27.67,20.53 27.47,20.33 U3.28
N$15
  Top 0.152: U3.27 26.77,15.01 27.15,14.63 C15.2
N$16  (via drill 0.35)  (3 unrouted)
  Top 0.152: SW4.B1 36.18,3.37 v36.17,3.38 | v26.24,3.28 26.26,3.25 26.26,2.08 SW3.B1
N$17
  Top 0.152: R4.2 1.44,29.49 CHRG1.5
N$18
  Top 0.152: LED3.C 12.74,8.76 R14.2
N$21
  Top 0.152: LED4.C R15.2
N$27
  Top 0.152: U1.13 23.3,21.09 23.04,20.83 20.78,20.83 20.43,21.17 Y1.P$1 19.89,21.55 17.78,21.55 17.12,22.21 C5.2
N$28
  Top 0.152: U1.14 24,22.92 23.65,23.27 20.77,23.27 Y1.P$2 20.24,22.77 19.99,22.52 C7.1
N$29
  Top 0.152: R7.1 LED1.A
N$30
  Top 0.152: R8.1 LED2.A
N$31
  Top 0.457: U1.10 20.07,24.71 17.29,27.5 L1.1
N$32
  Top 0.457: U1.9 20.25,25.41 18.99,26.68 L1.2 C2.1
RESET  (via drill 0.35)
  Top 0.152: U1.35 32.12,30.32 32.77,29.67 v32.77,29.59 | DEBUG1.10 36.86,25.93 36.86,13.15 R9.1 | R9.1 D3.+ C9.2 | RESET.1 34.52,13.31 R9.1
  Bottom 0.152: v32.77,29.59 32.77,29.05 33.4,28.42 33.4,26.31 33.86,25.86 35.31,25.86 36.07,26.62 DEBUG1.10
RXD.FT
  Top 0.152: R17.1 18.21,10.54 16.71,12.04 8.23,12.04 4.38,8.19 U2.4
RXD.NRF  (via drill 0.35)
  Top 0.152: U1.21 28.9,23.78 v28.37,24.31 | v20.65,11.96 20.65,9.87 R16.2
  Bottom 0.152: v20.65,11.96 20.65,15.43 19.1,16.97 19.1,17.98 19.82,18.69 21.63,18.69 27.25,24.3 v28.37,24.3 v28.37,24.31
RXLED
  Top 0.152: U2.17 10.47,8.19 R14.1
SCK  (via drill 0.35)
  Top 0.152: U3.18 20.47,17.62 v20.32,17.48 | U1.26 31.38,24.03 29.95,24.03 v29.87,23.95
  Bottom 0.152: v20.32,17.48 23.39,17.48 v29.87,23.95
SCL  (via drill 0.35)
  Top 0.152: U1.3 20.17,29.61 v20.14,29.59 | R2.1 3.95,32.23 5.87,32.23 6.27,32.63 J2.2
  Bottom 0.152: v20.14,29.59 19.02,30.71 16.2,30.71 12.82,34.09 6.78,34.09 6.27,33.59 J2.2
SDA  (via drill 0.35)
  Top 0.152: U1.2 22.2,30.55 v21.21,31.54 | J2.1 4.56,33 3.58,33.98 1.85,33.98 1.65,33.78 R1.1
  Bottom 0.152: v21.21,31.54 18.2,34.55 5.96,34.55 5,33.59 J2.1
SWCLK
  Top 0.152: U1.36 33.02,31.02 33.38,31.37 33.38,32.11 33.73,32.46 36.53,32.46 36.91,32.08 36.91,30.73 36.6,30.43 DEBUG1.4
SWDIO  (via drill 0.35)
  Top 0.152: U1.37 32.5,31.71 33.91,33.12 v34.24,33.12
  Bottom 0.152: DEBUG1.2 34.75,33.12 v34.24,33.12
SWO  (via drill 0.35)
  Top 0.152: U1.32 32.74,28.21 v32.77,28.19
  Bottom 0.152: v32.77,28.19 32.77,25.76 33.07,25.45 36.07,25.45 36.91,26.29 36.91,28.42 DEBUG1.6
TXD.FT
  Top 0.152: R16.1 18.59,8.94 17.48,10.06 17.48,10.85 16.59,11.73 9.47,11.73 8.67,10.94 U2.20
TXD.NRF  (via drill 0.35)
  Top 0.152: U1.19 27.5,23.42 v27.48,23.42 | v21.57,11.91 21.57,10.55 R17.2
  Bottom 0.152: v27.48,23.42 22.45,18.39 19.94,18.39 19.41,17.85 19.41,17.1 21.57,14.94 v21.57,11.91
TXLED  (via drill 0.35)
  Top 0.152: U2.10 4.05,4.38 4.39,4.72 4.39,5.51 6.88,8 6.88,9.73 v7.98,10.82 | v9.42,10.82 9.9,10.34 R15.1
  Bottom 0.152: v7.98,10.82 v9.42,10.82
USB+  (via drill 0.35)
  Top 0.152: v6.53,6.5 6.53,6.17 6.99,5.71 6.99,3.63 9.09,1.52 11.76,1.52 12.08,1.84 R12.1 13.91,2.56 C11.1
  Bottom 0.152: v6.53,6.5 6.13,6.1 USB1.3
USB-  (via drill 0.35)
  Top 0.152: R11.1 13.27,6.15 14.37,6.15 C10.2 15.34,2.08 14.48,1.22 8.97,1.22 6.38,3.81 v6.38,5.46
  Bottom 0.152: USB1.2 6.38,5.45 v6.38,5.46
V_USB  (via drill 0.35)
  Top 0.152: U2.15 7.99,6.92 v7.44,6.38
  Bottom 0.152: v7.44,6.38 7.44,4.83 D2.+
  Bottom 0.406: USB1.1 6.06,4.8 D2.+
VIN  (via drill 0.35)
  Top 0.152: R3.2 4.82,28.05 4.63,28.05 | 5.88,26.68 6.08,26.48 6.54,26.03 6.54,24.29 6.82,24 7.78,24 8.49,24.7 LDO1.3
  Top 0.66: CHRG1.4 4.63,28.05 C1.2 5.42,28.03 6.07,27.38 v6.07,26.49 6.08,26.48 | 5.88,26.68 C3.2 7.37,26.6 LDO1.1
  Bottom 0.66: v6.07,26.49 6.07,25.09 5.03,24.06 5.03,16.43 10.34,11.12 10.34,3.77 D1.- D2.-
VLIPO  (via drill 0.35)
  Top 0.152: J1.2 4.01,16.74 R5.2
  Top 0.66: CHRG1.3 C8.1 3.34,22.9 v3.53,22.71
  Bottom 0.61: 8.44,4.12 D1.+
  Bottom 0.66: v3.53,22.71 3.45,22.63 3.45,16.18 J1.2 3.91,12.88 3.91,12.17 8.44,7.64 8.44,4.12

### Text on the board
tNames: +
bNames: +